# Altium schematic sheet camadapter.SchDoc
size 420 x 297 mm; SheetNumber: 1; SheetTotal: 1
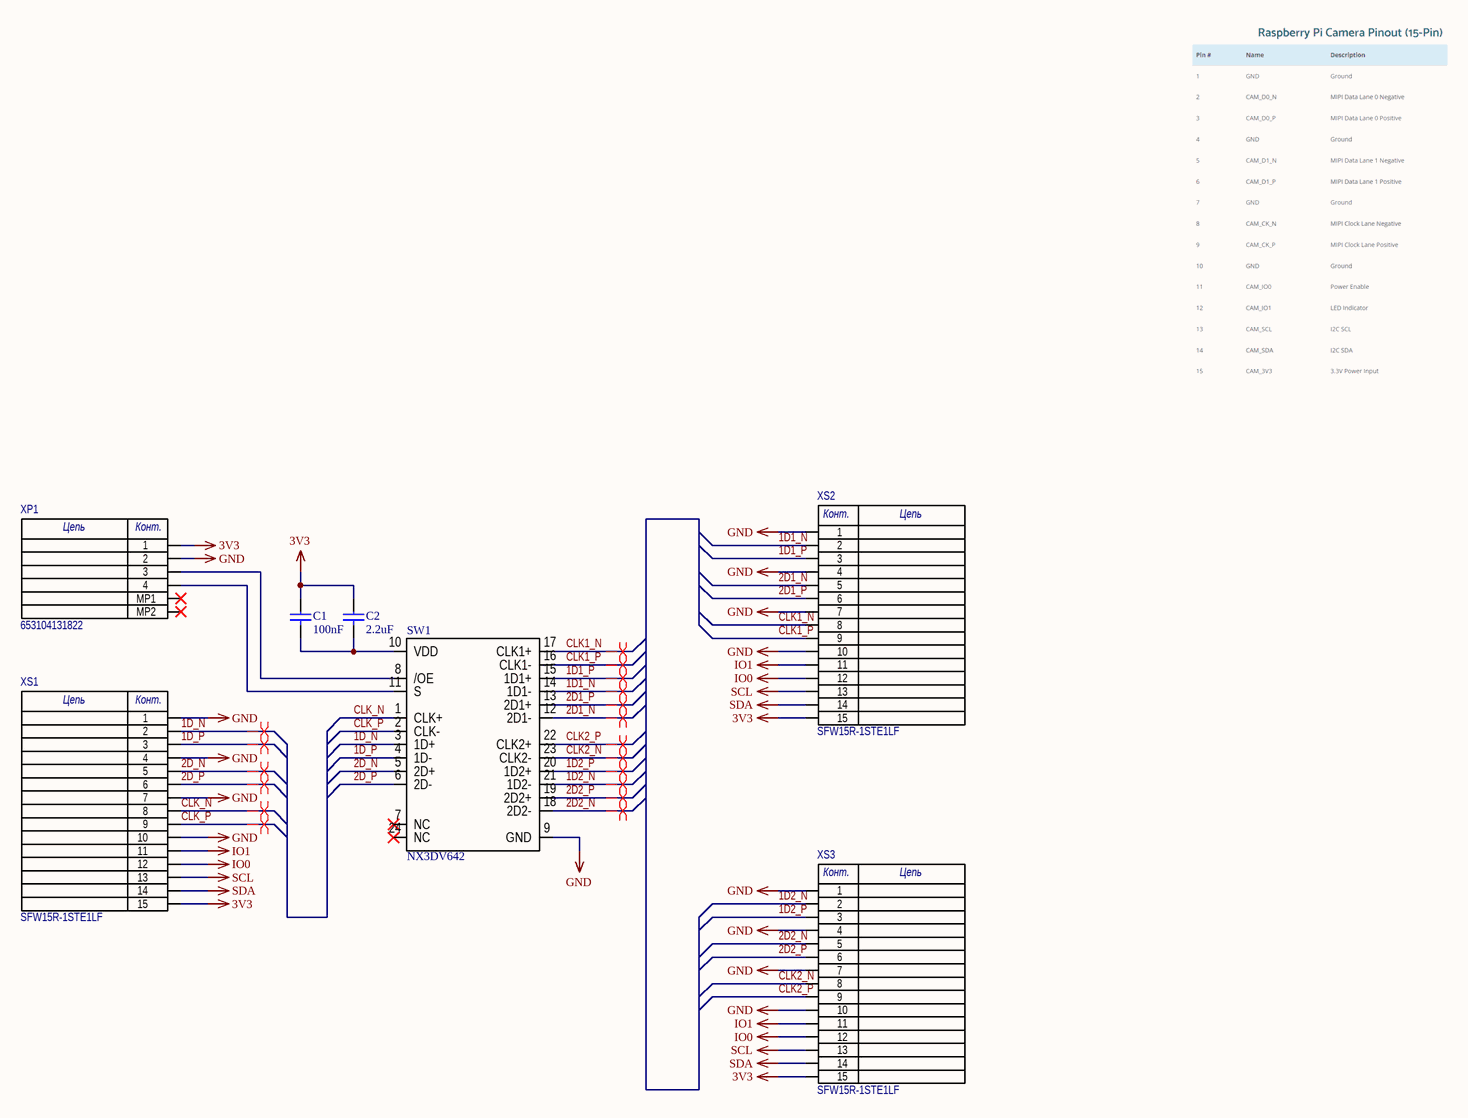
[diagram p0: camadapter.SchDoc]

## Parts
C1  100nF  [Cap_0402_N]
C2  2.2uF  [Cap_0402_N]
SW1  NX3DV642  [NX3DV642]
XP1  653104131822  [653104131822_D_arch]
XS1  SFW15R-1STE1LF  [SFW15R-1STE1LF_D]
XS2  SFW15R-1STE1LF  [SFW15R-1STE1LF_D]
XS3  SFW15R-1STE1LF  [SFW15R-1STE1LF_D]

## Nets
3V3: C1.2 C2.2 XP1.1 XS1.15 XS2.15 XS3.15
GND: SW1.9(GND) XP1.2 XS1.1 XS1.4 XS1.7 XS1.10 XS2.1 XS2.4 XS2.7 XS2.10 XS3.1 XS3.4 XS3.7 XS3.10
IO0: XS1.12 XS2.12 XS3.12
IO1: XS1.11 XS2.11 XS3.11
SCL: XS1.13 XS2.13 XS3.13
SDA: XS1.14 XS2.14 XS3.14
1D1_N: SW1.14(1D1-) XS2.2
1D1_P: SW1.15(1D1+) XS2.3
1D2_N: SW1.21(1D2-) XS3.2
1D2_P: SW1.20(1D2+) XS3.3
1D_N: SW1.3(1D+) XS1.2
1D_P: SW1.4(1D-) XS1.3
2D1_N: SW1.12(2D1-) XS2.5
2D1_P: SW1.13(2D1+) XS2.6
2D2_N: SW1.18(2D2-) XS3.5
2D2_P: SW1.19(2D2+) XS3.6
2D_N: SW1.5(2D+) XS1.5
2D_P: SW1.6(2D-) XS1.6
CLK1_N: SW1.17(CLK1+) XS2.8
CLK1_P: SW1.16(CLK1-) XS2.9
CLK2_N: SW1.23(CLK2-) XS3.8
CLK2_P: SW1.22(CLK2+) XS3.9
CLK_N: SW1.1(CLK+) XS1.8
CLK_P: SW1.2(CLK-) XS1.9
NetC1_1: C1.1 C2.1 SW1.10(VDD)
NetSW1_8: SW1.8(/OE) XP1.3
NetSW1_11: SW1.11(S) XP1.4

Not connected (* = marked no-connect by the designer): SW1 7(NC)* 24(NC)*; XP1 MP1* MP2*

## Layout directives
differential pair: 1D1_N, 1D1_P, 1D2_N, 1D2_P, 1D_N, 1D_P, 2D1_N, 2D1_P, 2D2_N, 2D2_P, 2D_N, 2D_P, CLK1_N, CLK1_P, CLK2_N, CLK2_P, CLK_N, CLK_P

## Notes on the sheet
- Подп. и дата
- Инв. № дубл.
- Взам. инв. №
- Инв. № подл.
- Изм.
- Лист
- № докум.
- Подп.
- Дата
- 2.106-A3
- Копировал
- Формат А3
- (in symbol 653104131822) Цепь; Конт.
- (in symbol SFW15R-1STE1LF) Конт.; Цепь

## Library data of the parts
C1 C2 = Cap_0402: Capacitor; Type: Capacitor; Part Number: Capacitor 0402
  C1: Value: 100nF
  C2: Value: 2.2uF
XP1 = 653104131822: Header, Pins, 4 Contacts, SMD, R/A, 0,049" (1,25mm).
XS1-XS3 = SFW15R-1STE1LF: FFC-FPC Connector, 15 Contacts, SMD, R/A, 0.039" (1.00mm).